# Altium schematic sheet Sheet1.SchDoc
size A4
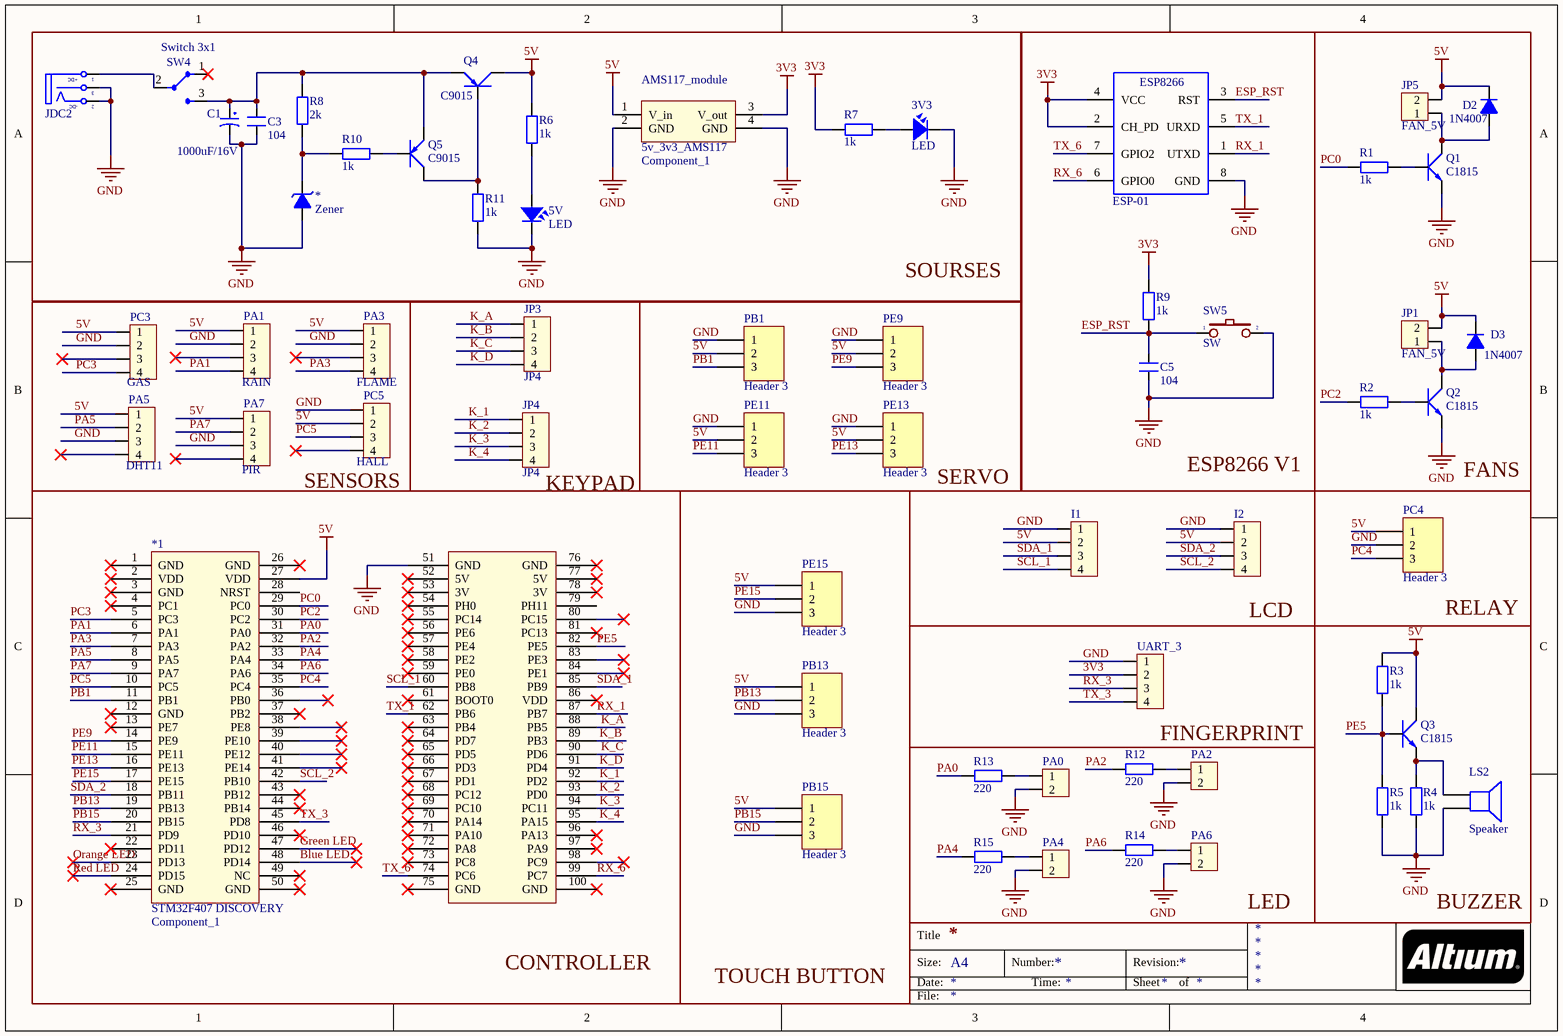
[diagram p0: Sheet1.SchDoc]

## Parts
3V3  LED  [LED-3]
5V  LED  [LED-3]
*  Zener  [D1A]
*1  Component_1  [MODULE_STM32F4DISCOVERY]
AMS117_module  Component_1  [PCBComponent_1]
C1  1000uF/16V  [CP1.5/3.4]
C3  104  [CN1.5]
C5  104  [CN1]
D2  1N4007  [D1A]
D3  1N4007  [D1A]
I1  (no value)  [CON4]
I2  (no value)  [CON4]
JDC2  Jac DC  [DC-IN]  (value not drawn)
JP1  FAN_5V  [CON2]
JP3  JP4  [CON4]
JP4  JP4  [CON4]
JP5  FAN_5V  [CON2]
LS2  Speaker  [SPEAKER]
PA0  (no value)  [CON2]
PA1  (no value)  [CON4]
PA2  (no value)  [CON2]
PA3  (no value)  [CON4]
PA4  (no value)  [CON2]
PA5  (no value)  [CON4]
PA6  (no value)  [CON2]
PA7  (no value)  [CON4]
PB1  Header 3  [HDR1X3]
PB13  Header 3  [HDR1X3]
PB15  Header 3  [HDR1X3]
PC3  (no value)  [CON4]
PC4  Header 3  [HDR1X3]
PC5  (no value)  [CON4]
PE9  Header 3  [HDR1X3]
PE11  Header 3  [HDR1X3]
PE13  Header 3  [HDR1X3]
PE15  Header 3  [HDR1X3]
Q1  C1815  [QTO-92]
Q2  C1815  [QTO-92]
Q3  C1815  [QTO-92]
Q4  C9015  [QTO-92]
Q5  C9015  [QTO-92]
R1  1k  [R1/4W]
R2  1k  [R1/4W]
R3  1k  [R1/4W]
R4  1k  [R1/4W]
R5  1k  [R1/4W]
R6  1k  [R1/4W]
R7  1k  [R1/4W]
R8  2k  [R1/4W]
R9  1k  [R1/4W]
R10  1k  [R1/4W]
R11  1k  [R1/4W]
R12  220  [R1/4W]
R13  220  [R1/4W]
R14  220  [R1/4W]
R15  220  [R1/4W]
SW4  Switch 3x1  [HDR1X3]
SW5  SW  [SW2]
U1  ESP-01  [ESP8266]
UART_3  (no value)  [CON4]

## Nets
3V3: AMS117_module.3(V_out) R7.1 R9.2 U1.2(CH_PD) U1.4(VCC) UART_3.2
5V: *1.27(VDD) AMS117_module.1(V_in) D2.2(K) D3.2(K) I1.2 I2.2 JP1.2 JP5.2 PA1.1 PA3.1 PA5.1 PA7.1 PB1.2 PB13.1 PB15.1 PC3.1 PC4.1 PC5.2 PE9.2 PE11.2 PE13.2 PE15.1 Q3.2(C) Q4.3(C) R3.2 R6.2
GND: 3V3.2 5V.2 *.1(A) *1.51(GND) AMS117_module.2(GND) AMS117_module.4(GND) C1.2 C3.1 C5.2 I1.1 I2.1 JDC2.2(TN) JDC2.3(S) LS2.2 PA0.2 PA1.2 PA2.2 PA3.2 PA4.2 PA5.3 PA6.2 PA7.3 PB1.1 PB13.3 PB15.3 PC3.2 PC4.2 PC5.1 PE9.1 PE11.1 PE13.1 PE15.3 Q1.1(E) Q2.1(E) R4.1 R5.1 R11.1 SW5.2 U1.8(GND) UART_3.1
Blue LED: *1.48(PD14)
ESP_RST: C5.1 R9.1 SW5.1 U1.3(RST)
Green LED: *1.47(PD12)
K_1: *1.92(PD2) JP4.1
K_2: *1.93(PD0) JP4.2
K_3: *1.94(PC11) JP4.3
K_4: *1.95(PA15) JP4.4
K_A: *1.88(PB5) JP3.1
K_B: *1.89(PB3) JP3.2
K_C: *1.90(PD6) JP3.3
K_D: *1.91(PD4) JP3.4
Orange LED: *1.23(PD13)
PA0: *1.31(PA0) R13.1
PA1: *1.6(PA1) PA1.4
PA2: *1.32(PA2) R12.1
PA3: *1.7(PA3) PA3.4
PA4: *1.33(PA4) R15.1
PA5: *1.8(PA5) PA5.2
PA6: *1.34(PA6) R14.1
PA7: *1.9(PA7) PA7.2
PB1: *1.11(PB1) PB1.3
PB13: *1.19(PB13) PB13.2
PB15: *1.20(PB15) PB15.2
PC0: *1.29(PC0) R1.1
PC2: *1.30(PC2) R2.1
PC3: *1.5(PC3) PC3.4
PC4: *1.35(PC4) PC4.3
PC5: *1.10(PC5) PC5.3
PE5: *1.82(PE5) Q3.3(B) R3.1 R5.2
PE9: *1.14(PE9) PE9.3
PE11: *1.15(PE11) PE11.3
PE13: *1.16(PE13) PE13.3
PE15: *1.17(PE15) PE15.2
Red LED: *1.24(PD15)
RX_1: *1.87(PB7) U1.1(UTXD)
RX_3: *1.21(PD9) UART_3.3
RX_6: *1.99(PC7) U1.6(GPIO0)
SCL_1: *1.60(PB8) I1.4
SCL_2: *1.42(PB10) I2.4
SDA_1: *1.85(PB9) I1.3
SDA_2: *1.18(PB11) I2.3
TX_1: *1.62(PB6) U1.5(URXD)
TX_3: *1.45(PD8) UART_3.4
TX_6: *1.74(PC6) U1.7(GPIO2)
Net3V3_1: 3V3.1 R7.2
Net5V_1: 5V.1 R6.1
Net*_2: *.2(K) R8.2 R10.2
NetC1_1: C1.1 C3.2 Q4.1(E) Q5.1(E) R8.1 SW4.3(I/O2)
NetD2_1: D2.1(A) JP5.1 Q1.2(C)
NetD3_1: D3.1(A) JP1.1 Q2.2(C)
NetJDC2_1: JDC2.1(T) SW4.2
NetLS2_1: LS2.1 Q3.1(E) R4.2
NetPA0_1: PA0.1 R13.2
NetPA2_1: PA2.1 R12.2
NetPA4_1: PA4.1 R15.2
NetPA6_1: PA6.1 R14.2
NetQ1_3: Q1.3(B) R1.2
NetQ2_3: Q2.3(B) R2.2
NetQ4_2: Q4.2(B) Q5.3(C) R11.2
NetQ5_2: Q5.2(B) R10.1

Not connected (* = marked no-connect by the designer): *1 1(GND)* 2(VDD)* 3(GND)* 4(PC1)* 12(GND)* 13(PE7)* 22(PD11)* 25(GND)* 26(GND)* 28(NRST) 36(PB0)* 37(PB2)* 38(PE8)* 39(PE10)* 40(PE12)* 41(PE14)* 43(PB12)* 44(PB14)* 46(PD10)* 49(NC)* 50(GND)* 52(5V)* 53(3V)* 54(PH0)* 55(PC14)* 56(PE6)* 57(PE4)* 58(PE2)* 59(PE0)* 61(BOOT0)* 63(PB4)* 64(PD7)* 65(PD5)* 66(PD3)* 67(PD1)* 68(PC12)* 69(PC10)* 70(PA14)* 71(PA10)* 72(PA8)* 73(PC8)* 75(GND)* 76(GND)* 77(5V)* 78(3V)* 79(PH11) 80(PC15)* 81(PC13)* 83(PE3)* 84(PE1)* 86(VDD)* 96(PA13)* 97(PA9)* 98(PC9)* 100(GND)*; PA1 3*; PA3 3*; PA5 4*; PA7 4*; PC3 3*; PC5 4*; SW4 1*

## Notes on the sheet
- SOURSES
- (near PC3) GAS
- (near PA1) RAIN
- (near PA3) FLAME
- (near PA5) DHT11
- (near PA7) PIR
- (near PC5) SENSORS
- (near PC5) HALL
- (near JP4) KEYPAD
- SERVO
- ESP8266 V1
- (near Q2) FANS
- (near I2) LCD
- RELAY
- FINGERPRINT
- LED
- BUZZER
- CONTROLLER
- TOUCH BUTTON
- Title
- Size:
- Date:
- A4
- Number:
- Time:
- Revision:
- Sheet
- of
- File:
- (in symbol Component_1) 5v_3v3_AMS117; STM32F407 DISCOVERY
- (in symbol DCIN) +DC; -DC
- (in symbol ESP8266-01) ESP8266

## Library data of the parts
3V3 5V = LED: LED Single colour Green and Red; Value: LED 3 ly Single Colour
C1 = CP4: Cap 1000uF/16V - 220uF/50V; Description 5: 4,7uF>10uF/250V_3,3uF>10uF/400V - 2,2uF>4,7uF/450V; Description 1: 2200uF-3300uF/6,3V - 1000uF-2200uF/10V; Description 2: 1000uF/16V - 470uF => 1000uF/25V - 100uF/100V; Description 3: 330uF>470uF/35V_220uF>470uF/50V_10uF>22uF/250V; Description 4: 220uF => 330uF/63V - 10uF =>33uF/160 - 200V; Value: 1000uF/16V
C3 = CN1.5: Cap np 682pF => 104pF; Value: 0.01uF
C5 = CN1: Cap np  1pF - 472pF; Value: 100pF
D2 D3 = D1A: Diode 1A; Value: 1N4007
I1 I2 JP3 JP4 PA1 PA3 PA5 PA7 PC3 PC5 UART_3 = Con4: Connector 4; Value: Connector 4
JDC2 = DCIN: Jac DC input; Value: Jac DC
JP1 JP5 PA0 PA2 PA4 PA6 = Con2: Connector 2; Value: Connector 2
LS2 = Speaker: Loudspeaker; Published: 24-Mar-1999; LatestRevisionDate: 17-Jul-2002; LatestRevisionNote: Re-released for DXP Platform.; PackageReference: PIN2; Publisher: Altium Limited
PB1 PB13 PB15 PC4 PE9 PE11 PE13 PE15 = Header 3: Header, 3-Pin; LatestRevisionDate: 17-Jul-2002; LatestRevisionNote: Re-released for DXP Platform.; Publisher: Altium Limited
Q1-Q3 = C1815: NPN 600mW, ECB; Value: C1815
Q4 Q5 = C9013: PNP 600mW, EBC; Value: C9015
R1-R15 = R1/4W: Resistor 1/4W; Value: R1/4W - 1K
SW4 = SW3x1: Value: Switch 4x2
SW5 = SW2: Switch button 2 pin; Value: SW chip 2 pin
U1 = ESP8266-01: ESP-12 Wi-Fi Module